# EAGLE design p1ac-001 (EAGLE 9.6.2)
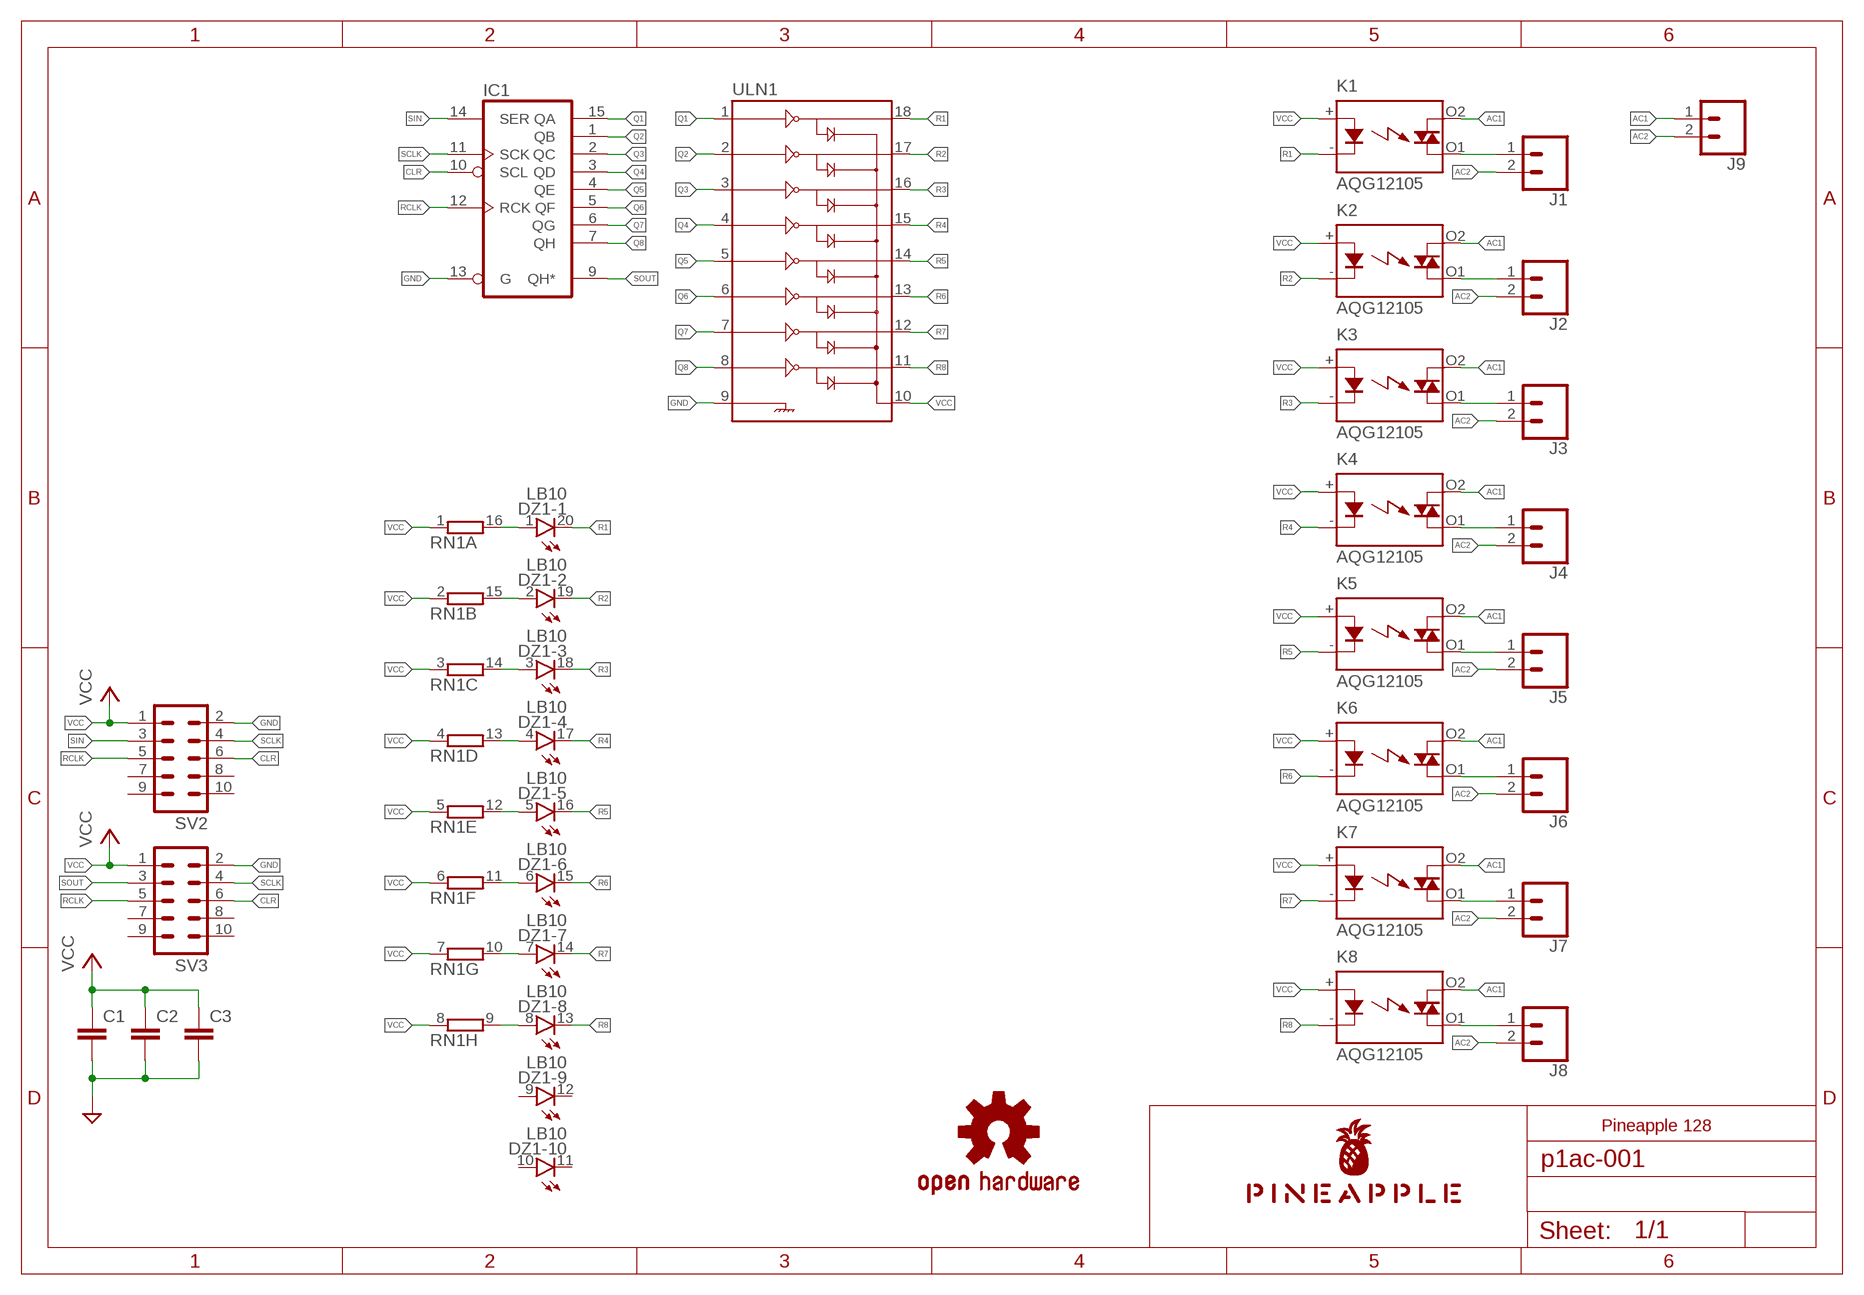
[diagram p0: schematic, sheet 1]

## Parts
C1  C-EU025-024X044  [C025-024X044]
C2  C-EU025-024X044  [C025-024X044]
C3  C-EU025-024X044  [C025-024X044]
DZ1  LB10  [LB10]
IC1  74LS595N  [DIL16]
J1  CONN_02POLAR  [MOLEX-1X2]
J2  CONN_02POLAR  [MOLEX-1X2]
J3  CONN_02POLAR  [MOLEX-1X2]
J4  CONN_02POLAR  [MOLEX-1X2]
J5  CONN_02POLAR  [MOLEX-1X2]
J6  CONN_02POLAR  [MOLEX-1X2]
J7  CONN_02POLAR  [MOLEX-1X2]
J8  CONN_02POLAR  [MOLEX-1X2]
J9  CONN_02POLAR  [MOLEX-1X2]
K1  AQG12105  [AQG]
K2  AQG12105  [AQG]
K3  AQG12105  [AQG]
K4  AQG12105  [AQG]
K5  AQG12105  [AQG]
K6  AQG12105  [AQG]
K7  AQG12105  [AQG]
K8  AQG12105  [AQG]
LOGO1  OSHW-LOGOS-COPPER  [OSHW-LOGO-S_COPPER]
RN1  8R-N  [DIL16]
SV2  ML10L  [ML10L]
SV3  ML10L  [ML10L]
U$1  PINEAPPLE450_SILK  [PINEAPPLE450_SILK]
ULN1  ULN2803DIP  [DIL18]

## Nets
AC1 [power]: J9.1 K1.O2(DS1) K2.O2(DS1) K3.O2(DS1) K4.O2(DS1) K5.O2(DS1) K6.O2(DS1) K7.O2(DS1) K8.O2(DS1)
AC2 [power]: J1.2 J2.2 J3.2 J4.2 J5.2 J6.2 J7.2 J8.2 J9.2
CLR: IC1.10(SCL) SV2.6 SV3.6
GND [gnd]: C1.2 C2.2 C3.2 IC1.13(G) SV2.2 SV3.2 ULN1.9
N$2: DZ1.1(-1:A) RN1.16
N$4: DZ1.2(-2:A) RN1.15
N$7: DZ1.3(-3:A) RN1.14
N$10: DZ1.4(-4:A) RN1.13
N$13: DZ1.5(-5:A) RN1.12
N$16: DZ1.6(-6:A) RN1.11
N$19: DZ1.7(-7:A) RN1.10
N$22: DZ1.8(-8:A) RN1.9
Q1: IC1.15(QA) ULN1.1
Q2: IC1.1(QB) ULN1.2
Q3: IC1.2(QC) ULN1.3
Q4: IC1.3(QD) ULN1.4
Q5: IC1.4(QE) ULN1.5
Q6: IC1.5(QF) ULN1.6
Q7: IC1.6(QG) ULN1.7
Q8: IC1.7(QH) ULN1.8
R1: DZ1.20(-1:C) K1.-(K) ULN1.18
R2: DZ1.19(-2:C) K2.-(K) ULN1.17
R3: DZ1.18(-3:C) K3.-(K) ULN1.16
R4: DZ1.17(-4:C) K4.-(K) ULN1.15
R5: DZ1.16(-5:C) K5.-(K) ULN1.14
R6: DZ1.15(-6:C) K6.-(K) ULN1.13
R7: DZ1.14(-7:C) K7.-(K) ULN1.12
R8: DZ1.13(-8:C) K8.-(K) ULN1.11
RCLK: IC1.12(RCK) SV2.5 SV3.5
SCLK: IC1.11(SCK) SV2.4 SV3.4
SIN: IC1.14(SER) SV2.3
SOUT: IC1.9(QH*) SV3.3
VCC: C1.1 C2.1 C3.1 K1.+(A) K2.+(A) K3.+(A) K4.+(A) K5.+(A) K6.+(A) K7.+(A) K8.+(A) RN1.1 RN1.2 RN1.3 RN1.4 RN1.5 RN1.6 RN1.7 RN1.8 SV2.1 SV3.1 ULN1.10
X1 [power]: J1.1 K1.O1(DS2)
X2 [power]: J2.1 K2.O1(DS2)
X3 [power]: J3.1 K3.O1(DS2)
X4 [power]: J4.1 K4.O1(DS2)
X5 [power]: J5.1 K5.O1(DS2)
X6 [power]: J6.1 K6.O1(DS2)
X7 [power]: J7.1 K7.O1(DS2)
X8 [power]: J8.1 K8.O1(DS2)
Unconnected: DZ1.9(-9:A) DZ1.10(-10:A) DZ1.11(-10:C) DZ1.12(-9:C) SV2.7 SV2.8 SV2.9 SV2.10 SV3.7 SV3.8 SV3.9 SV3.10

## Notes on the sheet
- Pineapple 128

## Power pins joined to a net without a drawn wire
GND: IC1.8(GND)
VCC: IC1.16(VCC)

## Library data of the parts
C1-C3 = resistor:C-EU: CAPACITOR, European symbol
DZ1 = led:LB10: LED BLOCK 10-LED bar graph, DIL, Siemens
IC1 = 74xx-us:74*595: 8-bit SHIFT REGISTER, output latch
J1-J9 = SparkFun-Connectors:CONN_02: Multi connection point. Often used as Generic Header-pin footprint for 0.1 inch spaced/style header connections On any of the 0.1 inch spaced packages, you can populate with these: Break Away Headers - Straight <https://www.sparkfun.com/products/116> (PRT-00116) Break Away Male Headers - Right Angle <https://www.sparkfun.com/products/553> (PRT-00553) Female Headers <https://www.sparkfun.com/products/115> (PRT-00115) Break Away Headers - Machine Pin <https://www.sparkfun.com/products/117> (PRT-00117) Break Away Female Headers - Swiss Machine Pin <https://www.sparkfun.com/products/743> (PRT-00743) For SCREWTERMINALS and SPRING TERMINALS visit here: Screw Terimnals on SparkFun.com <https://www.sparkfun.com/search/results?term=Screw+Terminals> (5mm/3.5mm/2.54mm spacing) This device is also useful as a general connection point to wire up your design to another part of your project. Our various solder wires solder well into these plated through hole pads. Hook-Up Wire - Assortment (Stranded, 22 AWG) <https://www.sparkfun.com/products/11375> (PRT-11375) Hook-Up Wire - Assortment (Solid Core, 22 AWG) <https://www.sparkfun.com/products/11367> (PRT-11367) View the entire wire category on our website here <https://www.sparkfun.com/categories/141> Special notes: Molex polarized connector foot print use with: PRT-08233 with associated crimp pins and housings. 2.54_SCREWTERM for use with PRT-10571. 3.5mm Screw Terminal footprints for PRT-08084 5mm Screw Terminal footprints for use with PRT-08432; SF_ID: PRT-09918
K1-K8 = relay:AQG*: SOLID STATE RELAY NAiS Zero-cross, Non zero-cross Source: http://www.mew-europe.com/.. en_ds_61611_0000.pdf; MF: AROMAT/ MATSUSHITA; MPN: AQG12105; OC_FARNELL: unknown; OC_NEWARK: 20J4759
LOGO1 = SparkFun-Aesthetics:OSHW-LOGO: Open-Source Hardware (OSHW) Logo This logo indicates the piece of hardware it is found on incorporates a OSHW license and/or adheres to the definition of open source hardware found here: http://freedomdefined.org/OSHW
RN1 = resistor-dil:8R-N: DIL RESISTOR; OC_FARNELL: unknown; OC_NEWARK: unknown
SV2 SV3 = con-ml:ML10L: HARTING; OC_FARNELL: unknown; OC_NEWARK: unknown
U$1 = pineapple:PINEAPPLE450_SILK
ULN1 = SparkFun-IC-Special-Function:ULN2803: Darlington Driver(IC-07959, low stock) ULN2803 Darlington array. 500mA max per channel, 8-channel package. Spark Fun Electronics SKU : COM-00312

## Net classes
0 default: width 0.152 mm, drill 0.152 mm, clearance 0.152 mm
1 gnd: width 0.61 mm, drill 0.152 mm, clearance 0.152 mm
2 power: width 0.61 mm, drill 0.152 mm, clearance 0.152 mm
3 analog: width 0.305 mm, drill 0.152 mm, clearance 0.152 mm

## Board
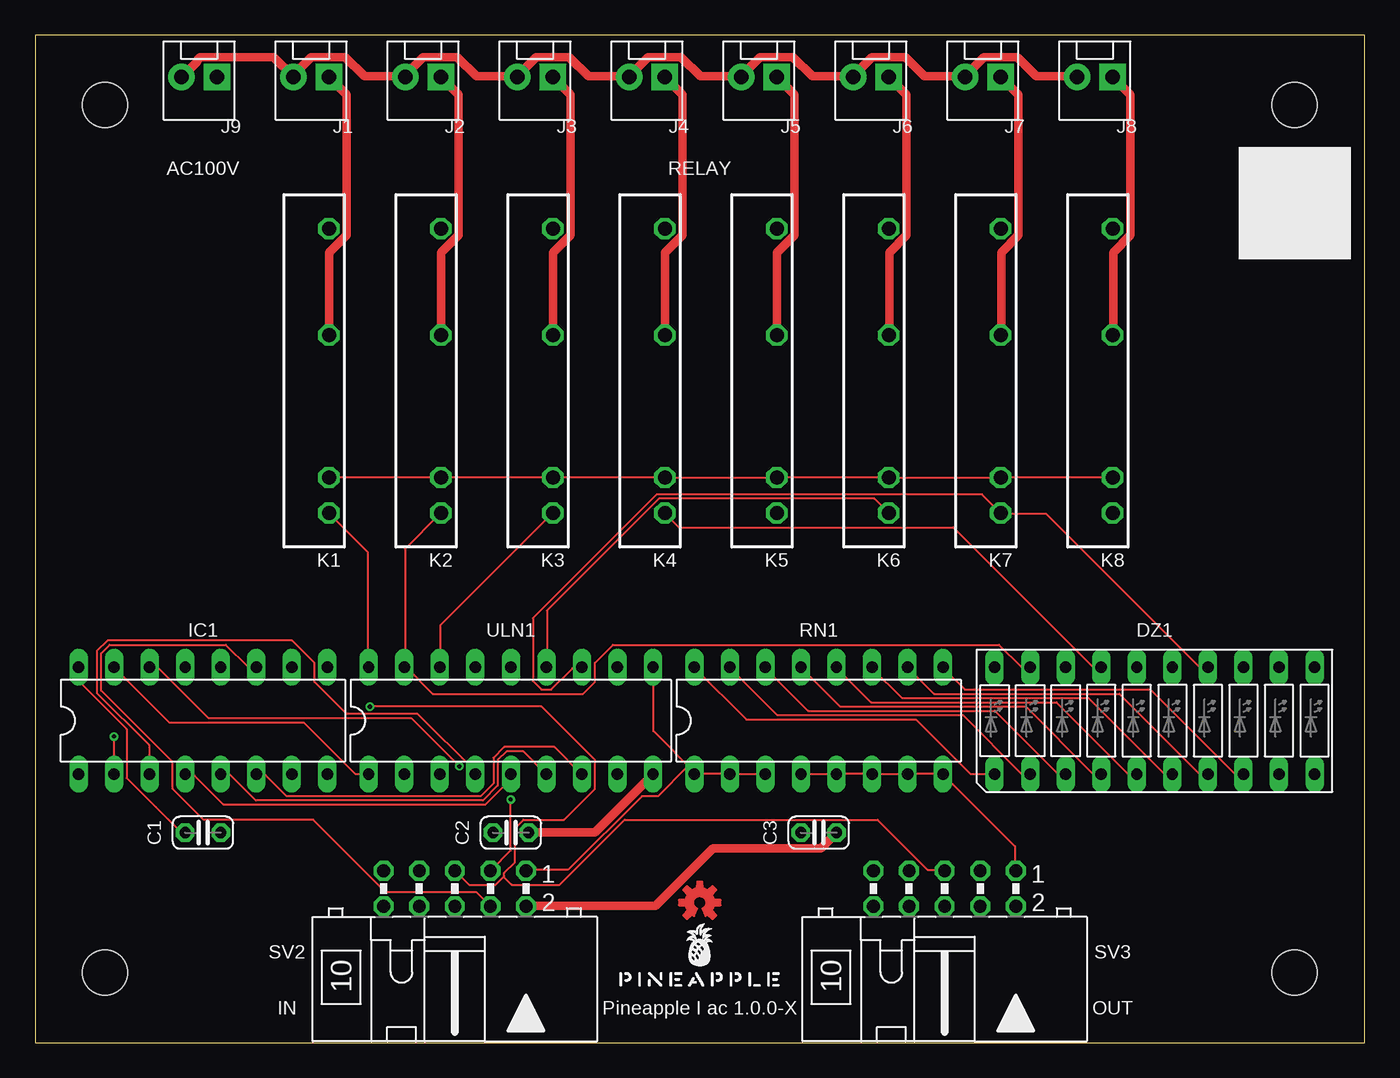
[diagram p1: board, top side]
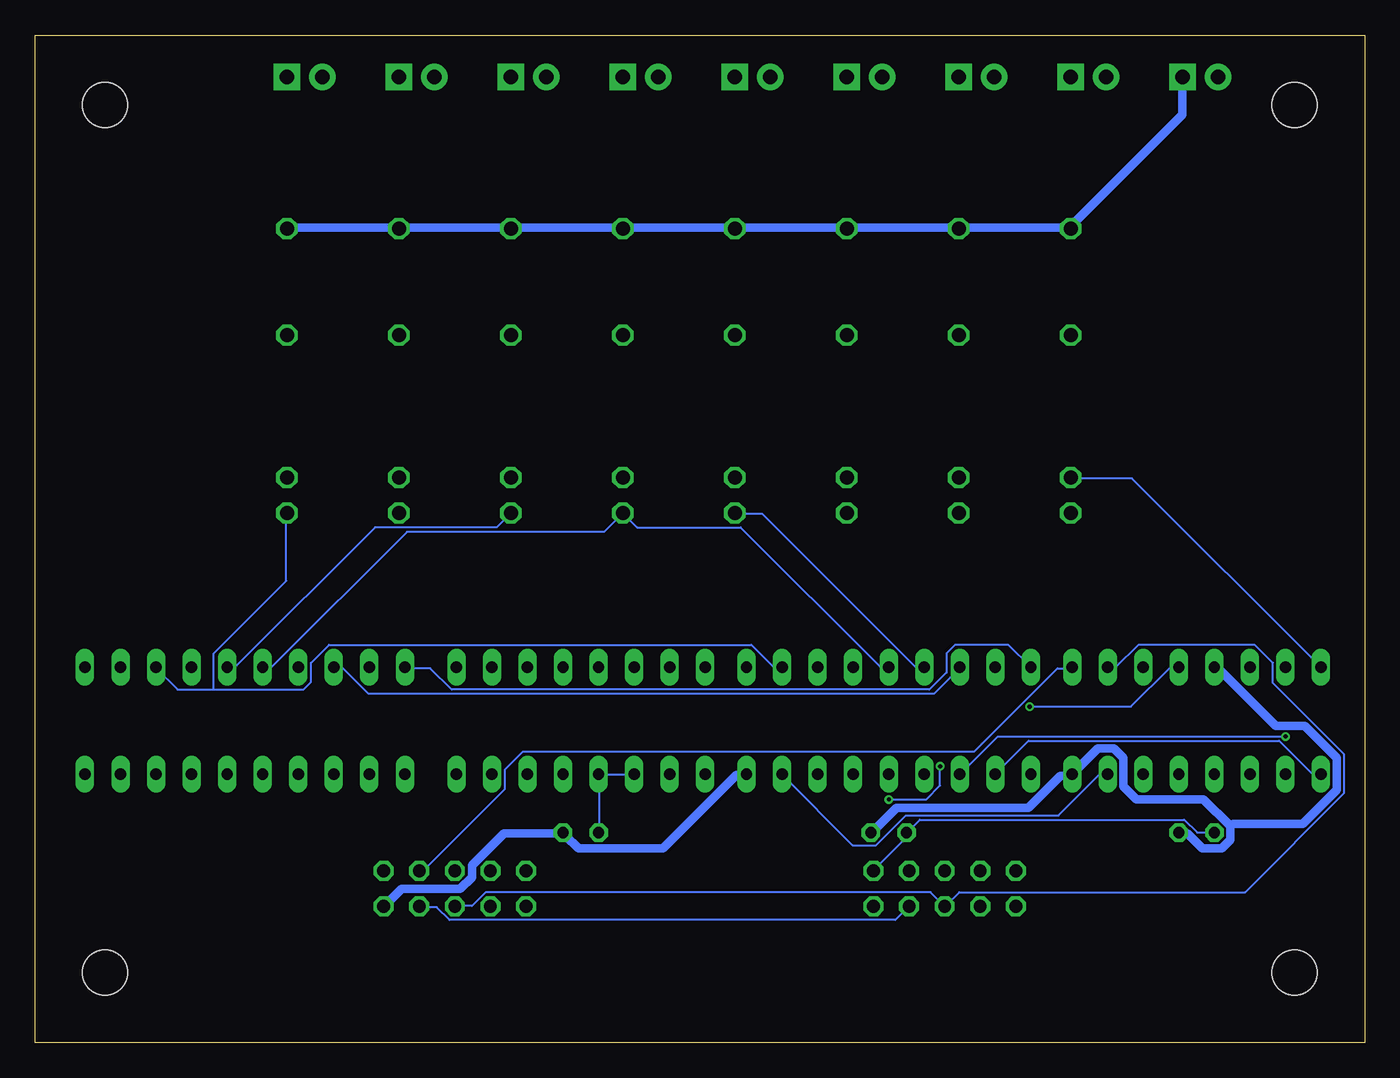
[diagram p2: board, bottom side, seen from below]

Size 95 x 72 mm. Coordinates in mm from the lower left corner, seen from the top.
Outline: 0,0 95,0 95,72 0,72 0,0
Copper layers (1*16): Top 0.035mm / dielectric 1.5mm / Bottom 0.035mm
Design rules "SeeedStudio_2layer_DRU_no_angle_20140221": minimum track width 6mil, minimum drill 12mil, track to track 6mil, track to pad 6mil, pad to pad 6mil, via to via 6mil, smd to smd 0mil, copper to edge 10mil, drill to drill 10mil, minimum pad ring 10mil, minimum via ring 6mil, stop-mask expansion 2mil, vias tented up to drill 100mil, thermal gap 10mil
Holes 3.2 mm at 5,5 90,5 90,67 5,67
tRestrict: area 2.8,64.8 to 7.2,69.2; area 87.8,64.8 to 92.2,69.2; area 2.8,2.8 to 7.2,7.2; area 87.8,2.8 to 92.2,7.2; area 0,71 to 95,72; area 0,0 to 1,72; area 0,0 to 95,1; area 94,0 to 95,72
bRestrict: area 2.8,2.8 to 7.2,7.2; area 87.8,2.8 to 92.2,7.2; area 87.8,64.8 to 92.2,69.2; area 2.8,64.8 to 7.2,69.2; area 0,71 to 95,72; area 0,0 to 1,72; area 0,0 to 95,1; area 94,0 to 95,72

### Footprints (pad centres in the part's own frame; a part is rotated, then mirrored left to right if it is on the bottom)
C025-024X044 = drill 0.813 octagon: 1 -1.27,0; 2 1.27,0
LB10 = drill 0.813 long: 1 -11.43,-3.81; 2 -8.89,-3.81; 3 -6.35,-3.81; 4 -3.81,-3.81; 5 -1.27,-3.81; 6 1.27,-3.81; 7 3.81,-3.81; 8 6.35,-3.81; 9 8.89,-3.81; 10 11.43,-3.81; 11 11.43,3.81; 12 8.89,3.81; 13 6.35,3.81; 14 3.81,3.81; 15 1.27,3.81; 16 -1.27,3.81; 17 -3.81,3.81; 18 -6.35,3.81; 19 -8.89,3.81; 20 -11.43,3.81
DIL16 = drill 0.813 long: 1 -8.89,-3.81; 2 -6.35,-3.81; 3 -3.81,-3.81; 4 -1.27,-3.81; 5 1.27,-3.81; 6 3.81,-3.81; 7 6.35,-3.81; 8 8.89,-3.81; 9 8.89,3.81; 10 6.35,3.81; 11 3.81,3.81; 12 1.27,3.81; 13 -1.27,3.81; 14 -3.81,3.81; 15 -6.35,3.81; 16 -8.89,3.81
MOLEX-1X2 = drill 1.016 pad 1.88 square: 1 0,0 | drill 1.016 pad 1.88: 2 2.54,0
AQG = drill 1 octagon: + -7.62,0; - -10.16,0; O1 2.54,0; O2 10.16,0
ML10L = drill 0.914 octagon: 1 -5.08,-1.27; 2 -5.08,1.27; 3 -2.54,-1.27; 4 -2.54,1.27; 5 0,-1.27; 6 0,1.27; 7 2.54,-1.27; 8 2.54,1.27; 9 5.08,-1.27; 10 5.08,1.27
DIL18 = drill 0.813 long: 1 -10.16,-3.81; 2 -7.62,-3.81; 3 -5.08,-3.81; 4 -2.54,-3.81; 5 0,-3.81; 6 2.54,-3.81; 7 5.08,-3.81; 8 7.62,-3.81; 9 10.16,-3.81; 10 10.16,3.81; 11 7.62,3.81; 12 5.08,3.81; 13 2.54,3.81; 14 0,3.81; 15 -2.54,3.81; 16 -5.08,3.81; 17 -7.62,3.81; 18 -10.16,3.81

### Placement (x,y rotation side)
C1  12,15 0 top
C2  34,15 0 top
C3  56,15 0 top
DZ1  80,23 0 top
IC1  12,23 0 top
J1  21,69 180 top
J2  29,69 180 top
J3  37,69 180 top
J4  45,69 180 top
J5  53,69 180 top
J6  61,69 180 top
J7  69,69 180 top
J8  77,69 180 top
J9  13,69 180 top
K1  21,48 90 top
K2  29,48 90 top
K3  37,48 90 top
K4  45,48 90 top
K5  53,48 90 top
K6  61,48 90 top
K7  69,48 90 top
K8  77,48 90 top
LOGO1  47.5,10 0 top
RN1  56,23 0 top
SV2  30,11 180 top
SV3  65,11 180 top
U$1  47.5,4 0 top
ULN1  34,23 0 top

### Tracks (layer width: path | path; a pad name or v marks a point on that pad's centre or on a via)
AC1
  Bottom 0.61: K8.O2 76.96,58.22 69.27,58.22 K7.O2 68.96,58.22 61.27,58.22 K6.O2 60.96,58.22 53.26,58.22 K5.O2 52.96,58.22 45.26,58.22 K4.O2 44.96,58.22 37.26,58.22 K3.O2 36.96,58.22 29.26,58.22 K2.O2 28.96,58.22 21.03,58.22 K1.O2 20.88,58.45 13.03,66.29 13.03,68.96 J9.1
AC2
  Top 0.61: J9.2 10.52,69.04 11.58,70.1 11.58,70.18 11.81,70.41 17.07,70.41 18.44,69.04 J1.2 18.59,69.27 19.74,70.41 22.17,70.41 23.55,69.04 26.44,69.04 J2.2 26.59,69.27 27.74,70.41 30.18,70.41 31.55,69.04 34.44,69.04 J3.2 34.67,69.27 35.81,70.41 38.18,70.41 39.55,69.04 42.44,69.04 J4.2 42.67,69.27 43.81,70.41 46.18,70.41 47.55,69.04 50.44,69.04 J5.2 50.67,69.27 51.82,70.41 54.18,70.41 55.55,69.04 58.45,69.04 J6.2 58.67,69.27 59.82,70.41 62.18,70.41 63.55,69.04 66.45,69.04 J7.2 66.67,69.27 67.82,70.41 70.18,70.41 71.55,69.04 74.45,69.04 J8.2
CLR
  Bottom 0.152: IC1.10 18.29,26.82 17.75,26.82 16.15,28.42 7.85,28.42 6.55,27.13 6.55,25.68 1.45,20.57 1.45,17.83 8.53,10.74 28.96,10.74 29.95,9.75 SV2.6 30.02,9.75 31.01,10.74 62.79,10.74 63.78,9.75 65,9.75 SV3.6
GND
  Top 0.61: C2.2 40.01,15.01 44.12,19.13 ULN1.9 | SV2.2 35.13,9.75 44.35,9.75 48.46,13.87 56.16,13.87 57.23,14.94 C3.2
  Bottom 0.61: 9.6,15.47 9.6,14.48 10.21,13.87 11.58,13.87 12.65,14.94 13.26,14.94 C1.2 | 9.6,15.47 11.51,17.37 16.31,17.37 17.22,18.29 17.22,20.34 17.91,21.03 19.05,21.03 20.88,19.2 IC1.8 21.18,19.05 21.72,19.05 24,16.76 33.45,16.76 35.2,15.01 C2.2 | IC1.13 10.67,26.75 10.44,26.75 6.33,22.63 4.27,22.63 1.98,20.34 1.98,18.06 4.42,15.62 9.37,15.62 9.6,15.47 | SV3.2 70.03,9.75 68.81,10.97 64.62,10.97 63.78,11.81 63.78,12.65 61.49,14.94 57.3,14.94 C3.2 57.07,14.78 56.16,13.87 50.14,13.87 44.88,19.13 44.2,19.13 ULN1.9
N$2
  Top 0.152: DZ1.1 68.5,19.2 66.83,19.2 62.94,23.09 50.83,23.09 47.17,26.75 RN1.16
N$4
  Top 0.152: DZ1.2 71.09,19.2 70.48,19.2 66.29,23.39 53.03,23.39 49.68,26.75 RN1.15
N$7
  Top 0.152: DZ1.3 73.61,19.2 73.08,19.2 68.58,23.7 55.24,23.7 52.2,26.75 RN1.14
N$10
  Top 0.152: DZ1.4 76.12,19.2 75.59,19.2 70.79,24 57.53,24 54.79,26.75 RN1.13
N$13
  Top 0.152: DZ1.5 78.72,19.2 78.11,19.2 73,24.31 59.74,24.31 57.3,26.75 RN1.12
N$16
  Top 0.152: DZ1.6 81.23,19.2 80.7,19.2 75.29,24.61 61.95,24.61 59.82,26.75 RN1.11
N$19
  Top 0.152: DZ1.7 83.74,19.2 83.21,19.2 77.5,24.92 64.24,24.92 62.41,26.75 RN1.10
N$22
  Top 0.152: DZ1.8 86.33,19.2 85.72,19.2 79.7,25.22 66.45,25.22 64.92,26.75 RN1.9
Q1
  Top 0.152: ULN1.1 23.77,19.2 22.86,19.2 19.2,22.86 9.6,22.86 5.71,26.75 IC1.15
Q2
  Bottom 0.152: IC1.1 3.12,19.2 3.73,19.2 6.1,21.57 24,21.57 26.36,19.2 ULN1.2
Q3  (via drill 0.3)
  Top 0.152: v5.64,21.87 5.64,19.2 IC1.2
  Bottom 0.152: v5.64,21.87 26.21,21.87 28.88,19.2 ULN1.3
Q4
  Top 0.152: IC1.3 8.15,19.2 8.15,21.26 4.42,24.99 4.42,27.96 5.18,28.73 18.36,28.73 19.96,27.13 19.96,25.76 22.25,23.47 27.36,23.47 31.39,19.43 31.39,19.2 ULN1.4
Q5
  Top 0.152: IC1.4 10.74,19.13 11.35,19.13 13.49,16.99 32.16,16.99 33.98,18.82 33.98,19.13 ULN1.5
Q6
  Top 0.152: IC1.5 13.34,19.13 13.95,19.13 15.77,17.3 32,17.3 33.07,18.36 33.07,20.19 33.68,20.8 34.9,20.8 36.5,19.2 ULN1.6
Q7
  Top 0.152: IC1.6 15.85,19.13 16.46,19.13 17.98,17.6 31.85,17.6 32.77,18.52 32.77,20.34 33.53,21.11 37.11,21.11 39.01,19.2 ULN1.7
Q8
  Bottom 0.152: IC1.7 18.36,19.13 18.97,19.13 21.87,16.23 32.77,16.23 34.9,14.1 36.58,14.1 41.6,19.13 ULN1.8
R1
  Top 0.152: ULN1.18 23.77,26.82 23.77,35.05 21.03,37.8 K1.-
  Bottom 0.152: DZ1.20 68.5,26.75 66.75,26.75 65.23,25.22 31.09,25.22 29.87,26.44 29.87,27.81 29.26,28.42 25.45,28.42 23.85,26.82 ULN1.18
R2
  Top 0.152: K2.- 28.96,37.8 26.44,35.28 26.44,26.82 ULN1.17 26.52,26.82 28.42,24.92 39.17,24.92 40.01,25.76 40.01,27.13 41.3,28.42 68.89,28.42 70.48,26.82 71.09,26.82 DZ1.19
R3
  Top 0.152: ULN1.16 28.96,26.82 28.96,29.79 36.96,37.8 K3.-
  Bottom 0.152: DZ1.18 73.61,26.75 73,26.75 71.17,24.92 30.79,24.92 28.96,26.75 ULN1.16
R4
  Top 0.152: DZ1.17 76.12,26.82 75.59,26.82 65.61,36.8 46.02,36.8 45.03,37.8 K4.-
  Bottom 0.152: ULN1.15 31.47,26.82 32.08,26.82 43.05,37.8 44.96,37.8 K4.-
R5
  Bottom 0.152: ULN1.14 34.06,26.82 34.59,26.82 44.58,36.8 51.97,36.8 52.96,37.8 K5.- 53.03,37.8 54.33,36.5 68.43,36.5 78.11,26.82 78.72,26.82 DZ1.16
R6
  Top 0.152: ULN1.13 36.58,26.82 36.58,30.86 44.58,38.86 59.97,38.86 60.96,37.87 K6.-
  Bottom 0.152: DZ1.15 81.23,26.82 80.7,26.82 70.71,36.8 62.03,36.8 61.04,37.8 K6.-
R7
  Top 0.152: ULN1.12 39.01,26.75 38.41,26.75 36.88,25.22 36.2,25.22 35.59,25.83 35.59,30.33 44.42,39.17 67.67,39.17 68.96,37.87 K7.- 69.04,37.8 72.24,37.8 83.21,26.82 83.74,26.82 DZ1.14
R8
  Bottom 0.152: 82.22,25.22 84.81,25.22 86.33,26.75 DZ1.13 | 82.22,25.22 75.82,25.22 75.29,25.76 75.29,27.13 73.99,28.42 43.81,28.42 42.22,26.82 41.68,26.82 ULN1.11 | 82.22,25.22 82.22,27.81 77.04,32.99 77.04,37.8 K8.-
RCLK  (via drill 0.3)
  Top 0.152: v23.93,24 36.2,24 40.01,20.19 40.01,18.14 37.8,15.93 34.9,15.93 34.29,15.32 34.29,12.88 33.53,12.12 33.53,11.89 33.49,11.85 | 33.49,11.85 32.92,11.28 31.01,11.28 30.02,12.27 SV2.5 | 33.49,11.85 34.06,11.28 37.49,11.28 42.14,15.93 60.2,15.93 63.78,12.34 65,12.34 SV3.5
  Bottom 0.152: v23.93,24 16.69,24 13.95,26.75 13.34,26.75 IC1.12
SCLK
  Top 0.152: IC1.11 15.77,26.82 15.24,26.82 13.64,28.42 5.33,28.42 4.72,27.81 4.72,25.15 9.83,20.04 9.83,18.14 12.04,15.93 19.89,15.93 25.07,10.74 31.55,10.74 32.54,9.75 SV2.4
  Bottom 0.152: SV3.4 67.51,9.68 66.29,9.68 65.38,8.76 33.53,8.76 32.61,9.68 SV2.4
SIN  (via drill 0.3)
  Top 0.152: v30.33,19.74 26.9,23.16 12.42,23.16 8.84,26.75 8.23,26.75 IC1.14 | v33.98,17.37 33.98,13.72 32.61,12.34 SV2.3
  Bottom 0.152: v30.33,19.74 30.33,18.36 31.32,17.37 v33.98,17.37
SOUT
  Bottom 0.152: IC1.9 20.95,26.75 21.95,26.75 27.89,20.8 60.12,20.8 61.42,19.51 61.42,18.14 67.21,12.34 67.51,12.34 SV3.3
VCC
  Top 0.152: K8.+ 76.96,40.39 69.04,40.39 K7.+ 68.96,40.39 61.04,40.39 K6.+ 60.96,40.39 53.03,40.39 K5.+ 52.96,40.39 45.03,40.39 K4.+ 44.96,40.39 37.03,40.39 K3.+ 36.96,40.39 29.03,40.39 K2.+ 28.96,40.39 21.03,40.39 K1.+ | C1.1 10.67,15.01 10.44,15.01 6.55,18.9 6.55,22.4 3.12,25.83 3.12,26.75 IC1.16 | SV3.1 70.03,12.34 70.03,14.02 64.92,19.13 RN1.8 64.85,19.2 62.41,19.2 RN1.7 62.33,19.2 59.82,19.2 RN1.6 59.74,19.2 57.3,19.2 RN1.5 57.23,19.2 54.79,19.2 RN1.4 | RN1.1 47.17,19.2 49.61,19.2 RN1.2 49.68,19.2 52.12,19.2 RN1.3 | ULN1.10 44.2,26.75 44.2,22.25 47.17,19.28 RN1.1 | SV2.1 35.13,12.34 38.1,12.34 43.36,17.6 44.5,17.6 46.63,19.74 RN1.1
  Bottom 0.152: C3.1 54.71,15.01 54.71,19.13 RN1.4 54.63,19.13 52.2,19.13 RN1.3 | SV2.1 35.05,12.34 32.77,14.63 32.77,14.94 C2.1 32.69,15.01 31.77,15.93 12.88,15.93 11.96,15.01 10.74,15.01 C1.1 | K1.+ 20.95,40.31 16.61,40.31 3.12,26.82 IC1.16
X1
  Top 0.61: K1.O1 21.03,50.6 21.03,56.46 22.25,57.68 22.25,67.74 21.03,68.96 J1.1
X2
  Top 0.61: K2.O1 29.03,50.6 29.03,56.46 30.25,57.68 30.25,67.74 29.03,68.96 J2.1
X3
  Top 0.61: K3.O1 37.03,50.6 37.03,56.46 38.25,57.68 38.25,67.74 37.03,68.96 J3.1
X4
  Top 0.61: K4.O1 45.03,50.6 45.03,56.46 46.25,57.68 46.25,67.74 45.03,68.96 J4.1
X5
  Top 0.61: K5.O1 53.03,50.6 53.03,56.46 54.25,57.68 54.25,67.74 53.03,68.96 J5.1
X6
  Top 0.61: K6.O1 61.04,50.6 61.04,56.46 62.26,57.68 62.26,67.74 61.04,68.96 J6.1
X7
  Top 0.61: K7.O1 69.04,50.6 69.04,56.46 70.26,57.68 70.26,67.74 69.04,68.96 J7.1
X8
  Top 0.61: K8.O1 77.04,50.6 77.04,56.46 78.26,57.68 78.26,67.74 77.04,68.96 J8.1

### Text on the board
tNames: AC100V | RELAY | IN | Pineapple I ac 1.0.0-X | OUT